# EAGLE design wavplayer-v4 (EAGLE 6.5.0)
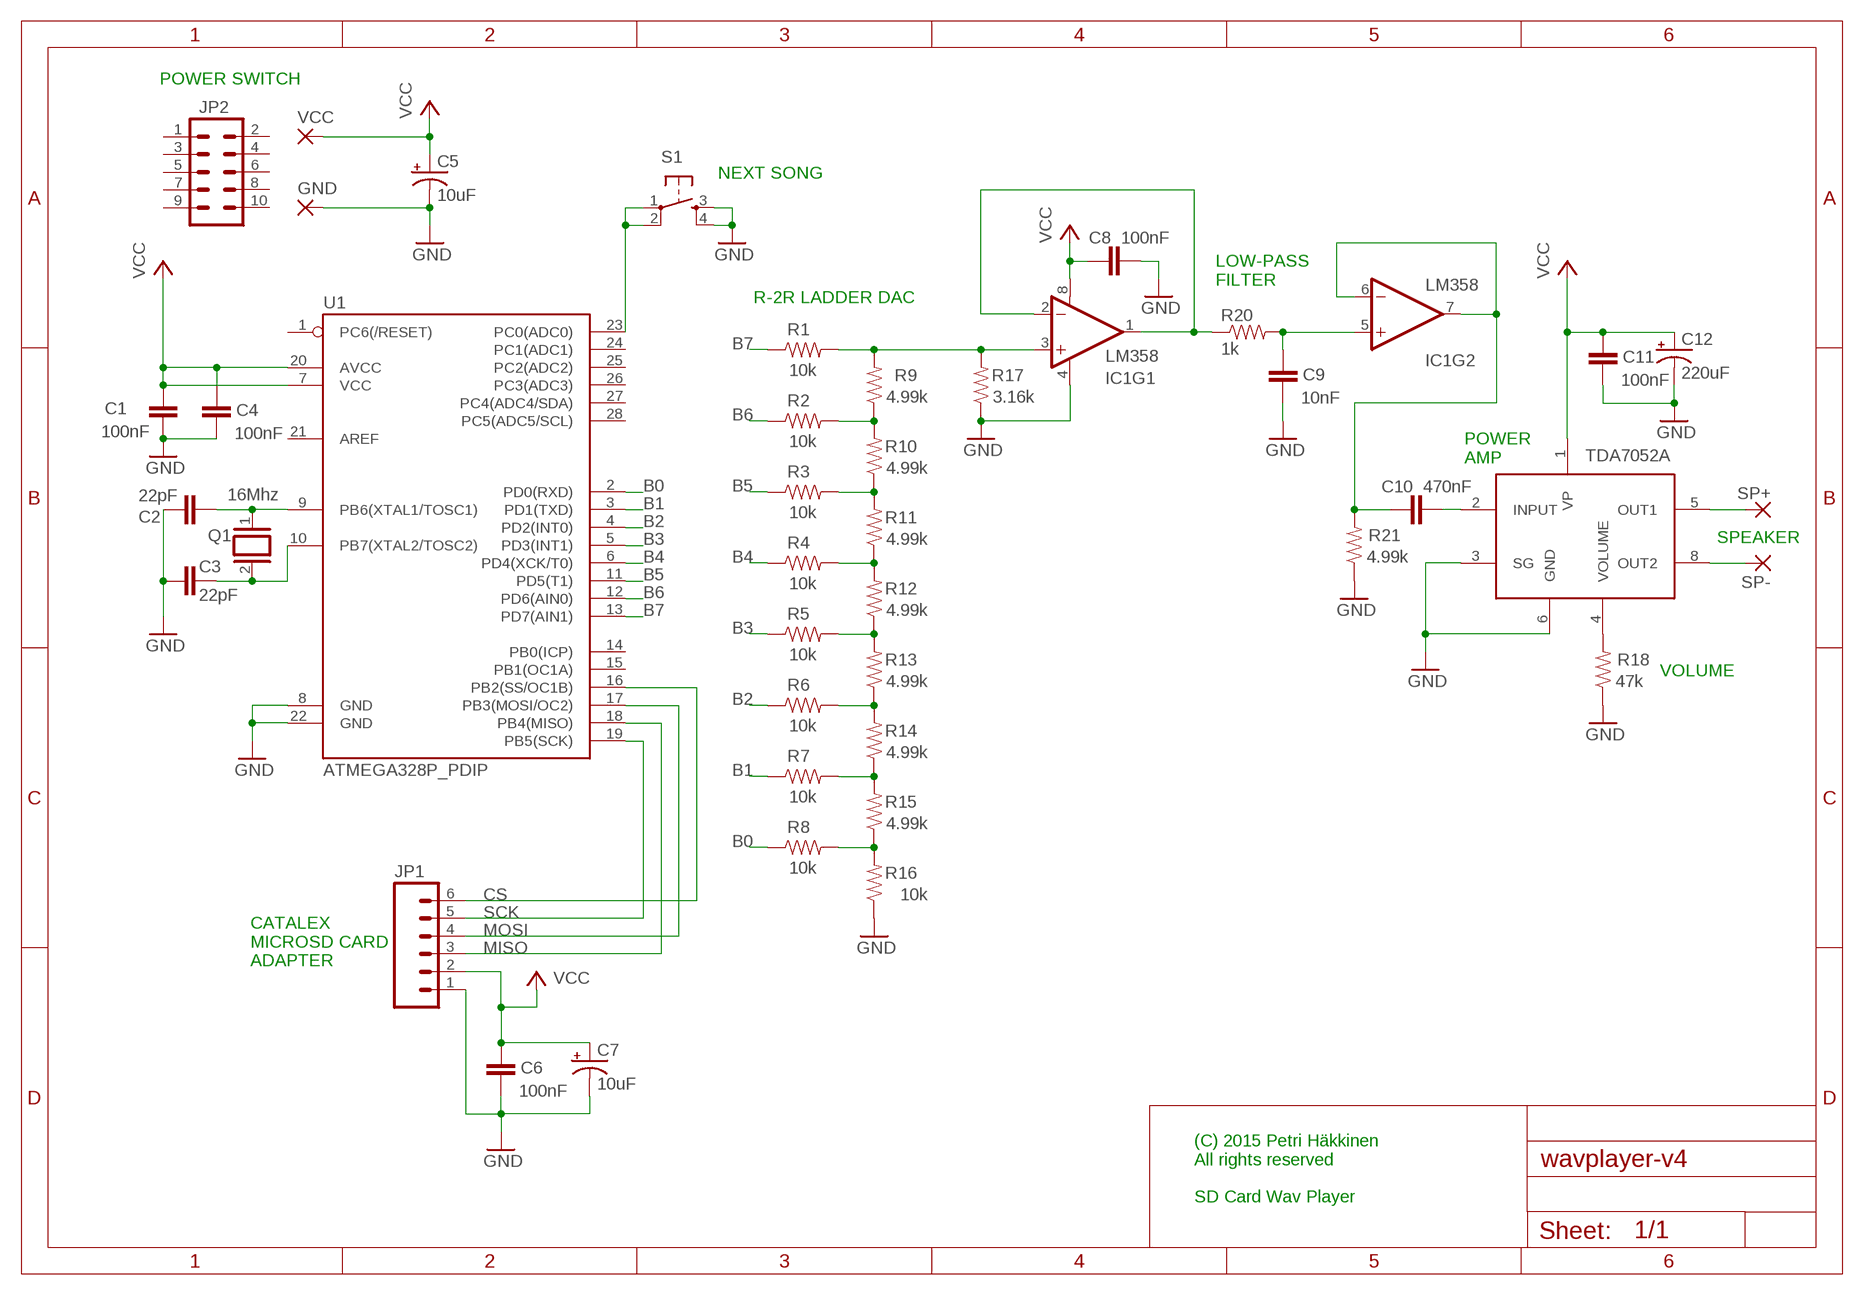
[diagram p0: schematic, sheet 1]

## Parts
C1  100nF  CAPPTH  [CAP-PTH-SMALL]
C2  22pF  CAPPTH  [CAP-PTH-SMALL]
C3  22pF  CAPPTH  [CAP-PTH-SMALL]
C4  100nF  CAPPTH  [CAP-PTH-SMALL]
C5  10uF  CAP_POLPTH1  [CPOL-RADIAL-100UF-25V]
C6  100nF  CAPPTH  [CAP-PTH-SMALL]
C7  10uF  CAP_POLPTH1  [CPOL-RADIAL-100UF-25V]
C8  100nF  CAPPTH  [CAP-PTH-SMALL]
C9  10nF  CAPPTH  [CAP-PTH-SMALL]
C10  470nF  CAPPTH  [CAP-PTH-SMALL]
C11  100nF  CAPPTH  [CAP-PTH-SMALL]
C12  220uF  CAP_POLPTH1  [CPOL-RADIAL-100UF-25V]
GND  WIREPAD2,15/1,0  [2,15/1,0]
IC1  LM358  [DIP08]
JP1  M06LONGPADS  [1X06_LONGPADS]
JP2  M05X2NO_SILK  [2X5_NOSILK]
Q1  16Mhz  XTAL/S  [QS]
R1  10k  RESISTORPTH-1/4W  [AXIAL-0.4]
R2  10k  RESISTORPTH-1/4W  [AXIAL-0.4]
R3  10k  RESISTORPTH-1/4W  [AXIAL-0.4]
R4  10k  RESISTORPTH-1/4W  [AXIAL-0.4]
R5  10k  RESISTORPTH-1/4W  [AXIAL-0.4]
R6  10k  RESISTORPTH-1/4W  [AXIAL-0.4]
R7  10k  RESISTORPTH-1/4W  [AXIAL-0.4]
R8  10k  RESISTORPTH-1/4W  [AXIAL-0.4]
R9  4.99k  RESISTORPTH-1/4W  [AXIAL-0.4]
R10  4.99k  RESISTORPTH-1/4W  [AXIAL-0.4]
R11  4.99k  RESISTORPTH-1/4W  [AXIAL-0.4]
R12  4.99k  RESISTORPTH-1/4W  [AXIAL-0.4]
R13  4.99k  RESISTORPTH-1/4W  [AXIAL-0.4]
R14  4.99k  RESISTORPTH-1/4W  [AXIAL-0.4]
R15  4.99k  RESISTORPTH-1/4W  [AXIAL-0.4]
R16  10k  RESISTORPTH-1/4W  [AXIAL-0.4]
R17  3.16k  RESISTORPTH-1/4W  [AXIAL-0.4]
R18  47k  RESISTORPTH-1/4W-VERT  [AXIAL-0.1]
R20  1k  RESISTORPTH-1/4W  [AXIAL-0.4]
R21  4.99k  RESISTORPTH-1/4W  [AXIAL-0.4]
S1  TAC_SWITCHPTH  [TACTILE-PTH]
SP+  WIREPAD2,15/1,0  [2,15/1,0]
SP-  WIREPAD2,15/1,0  [2,15/1,0]
U1  ATMEGA328P_PDIP  [DIL28-3]
U$1  TDA7052B  [DIL08]
VCC  WIREPAD2,15/1,0  [2,15/1,0]

## Nets
B0: R8.P$1 U1.2(PD0(RXD))
B1: R7.P$1 U1.3(PD1(TXD))
B2: R6.P$1 U1.4(PD2(INT0))
B3: R5.P$1 U1.5(PD3(INT1))
B4: R4.P$1 U1.6(PD4(XCK/T0))
B5: R3.P$1 U1.11(PD5(T1))
B6: R2.P$1 U1.12(PD6(AIN0))
B7: R1.P$1 U1.13(PD7(AIN1))
CS: JP1.6 U1.16(PB2(SS/OC1B))
GND: C1.2 C2.2 C3.2 C4.2 C5.2(-) C6.2 C7.2(-) C8.2 C9.2 C11.2 C12.2(-) GND.1(P) IC1.4(V-) JP1.1 R16.P$1 R17.P$1 R18.P$1 R21.P$1 S1.3 S1.4 U1.8(GND) U1.22(GND) U$1.3(SG) U$1.6(GND)
MISO: JP1.3 U1.18(PB4(MISO))
MOSI: JP1.4 U1.17(PB3(MOSI/OC2))
N$1: C2.1 Q1.1 U1.9(PB6(XTAL1/TOSC1))
N$2: C3.1 Q1.2 U1.10(PB7(XTAL2/TOSC2))
N$3: R4.P$2 R11.P$1 R12.P$2
N$4: R5.P$2 R12.P$1 R13.P$2
N$5: R6.P$2 R13.P$1 R14.P$2
N$6: R3.P$2 R10.P$1 R11.P$2
N$7: R7.P$2 R14.P$1 R15.P$2
N$8: R2.P$2 R9.P$1 R10.P$2
N$9: R8.P$2 R15.P$1 R16.P$2
N$10: IC1.3(+IN) R1.P$2 R9.P$2 R17.P$2
N$11: C9.1 IC1.5(+IN) R20.P$2
N$12: C10.1 IC1.6(-IN) IC1.7(OUT) R21.P$2
N$13: IC1.1(OUT) IC1.2(-IN) R20.P$1
N$14: SP-.1(P) U$1.8(OUT2)
N$16: SP+.1(P) U$1.5(OUT1)
N$18: C10.2 U$1.2(INPUT)
N$19: R18.P$2 U$1.4(VOLUME)
N$25: S1.1 S1.2 U1.23(PC0(ADC0))
SCK: JP1.5 U1.19(PB5(SCK))
VCC: C1.1 C4.1 C5.1(+) C6.1 C7.1(+) C8.1 C11.1 C12.1(+) IC1.8(V+) JP1.2 U1.7(VCC) U1.20(AVCC) U$1.1(VP) VCC.1(P)
Unconnected: JP2.1 JP2.2 JP2.3 JP2.4 JP2.5 JP2.6 JP2.7 JP2.8 JP2.9 JP2.10 U1.1(PC6(/RESET)) U1.14(PB0(ICP)) U1.15(PB1(OC1A)) U1.21(AREF) U1.24(PC1(ADC1)) U1.25(PC2(ADC2)) U1.26(PC3(ADC3)) U1.27(PC4(ADC4/SDA)) U1.28(PC5(ADC5/SCL))

## Notes on the sheet
- POWER SWITCH
- NEXT SONG
- LOW-PASS
  FILTER
- R-2R LADDER DAC
- TDA7052A
- POWER
  AMP
- SPEAKER
- VOLUME
- CATALEX
  MICROSD CARD
  ADAPTER
- (C) 2015 Petri Häkkinen
  All rights reserved
  
  SD Card Wav Player

## Library data of the parts
C1-C4 C6 C8-C11 = SparkFun-Capacitors:CAP: Capacitor Standard 0603 ceramic capacitor, and 0.1" leaded capacitor.
C5 C7 C12 = SparkFun-Capacitors:CAP_POL: Capacitor Polarized These are standard SMD and PTH capacitors. Normally 10uF, 47uF, and 100uF in electrolytic and tantalum varieties. Always verify the external diameter of the through hole cap, it varies with capacity, voltage, and manufacturer. The EIA devices should be standard.
GND SP+ SP- VCC = wirepad:WIREPAD: Wire PAD connect wire on PCB
IC1 = SparkFun-AnalogIC:LM358: Jellybean op-amp; PROD_ID: IC-09172
JP1 = SparkFun-Connectors:M06: Header 6 Standard 6-pin 0.1" header. Use with straight break away headers (SKU : PRT-00116), right angle break away headers (PRT-00553), swiss pins (PRT-00743), machine pins (PRT-00117), and female headers (PRT-00115). Molex polarized connector foot print use with SKU : PRT-08094 with associated crimp pins and housings. NOTES ON THE VARIANTS LOCK and LOCK_LONGPADS... This footprint was designed to help hold the alignment of a through-hole component (i.e. 6-pin header) while soldering it into place. You may notice that each hole has been shifted either up or down by 0.005 of an inch from it's more standard position (which is a perfectly straight line). This slight alteration caused the pins (the squares in the middle) to touch the edges of the holes. Because they are alternating, it causes a "brace" to hold the component in place. 0.005 has proven to be the perfect amount of "off-center" position when using our standard breakaway headers. Although looks a little odd when you look at the bare footprint, once you have a header in there, the alteration is very hard to notice. Also,if you push a header all the way into place, it is covered up entirely on the bottom side. This idea of altering the position of holes to aid alignment will be further integrated into the Sparkfun Library for other footprints. It can help hold any component with 3 or more connection pins.
JP2 = SparkFun-Connectors:M05X2: Header 5x2 Standard 10-pin dual row 0.1" header. Commonly used with AVR-ISP. Use with Spark Fun Electronics SKU: PRT-00778
Q1 = special:XTAL/S: CRYSTAL
R1-R17 R20 R21 = SparkFun-Passives:RESISTOR: Resistor Basic schematic elements and footprints for 0603, 1206, and PTH resistors.
R18 = SparkFun-Resistors:RESISTOR: Resistor Basic schematic elements and footprints for 0603, 1206, and PTH resistors.
S1 = SparkFun-Electromechanical:TAC_SWITCH: Momentary Switch Button commonly used for reset or general input. Spark Fun Electronics SKU : COM-00097 SMT- SWCH-08247
U1 = SparkFun-DigitalIC:ATMEGA328P_PDIP: uC used in the Arduino 32kb flash, 1k EEPROM, 2k SRAM This is the through-hole version of this chip.
U$1 = tda7052b:TDA7052B: 1W Mono audio amplifier

## Board
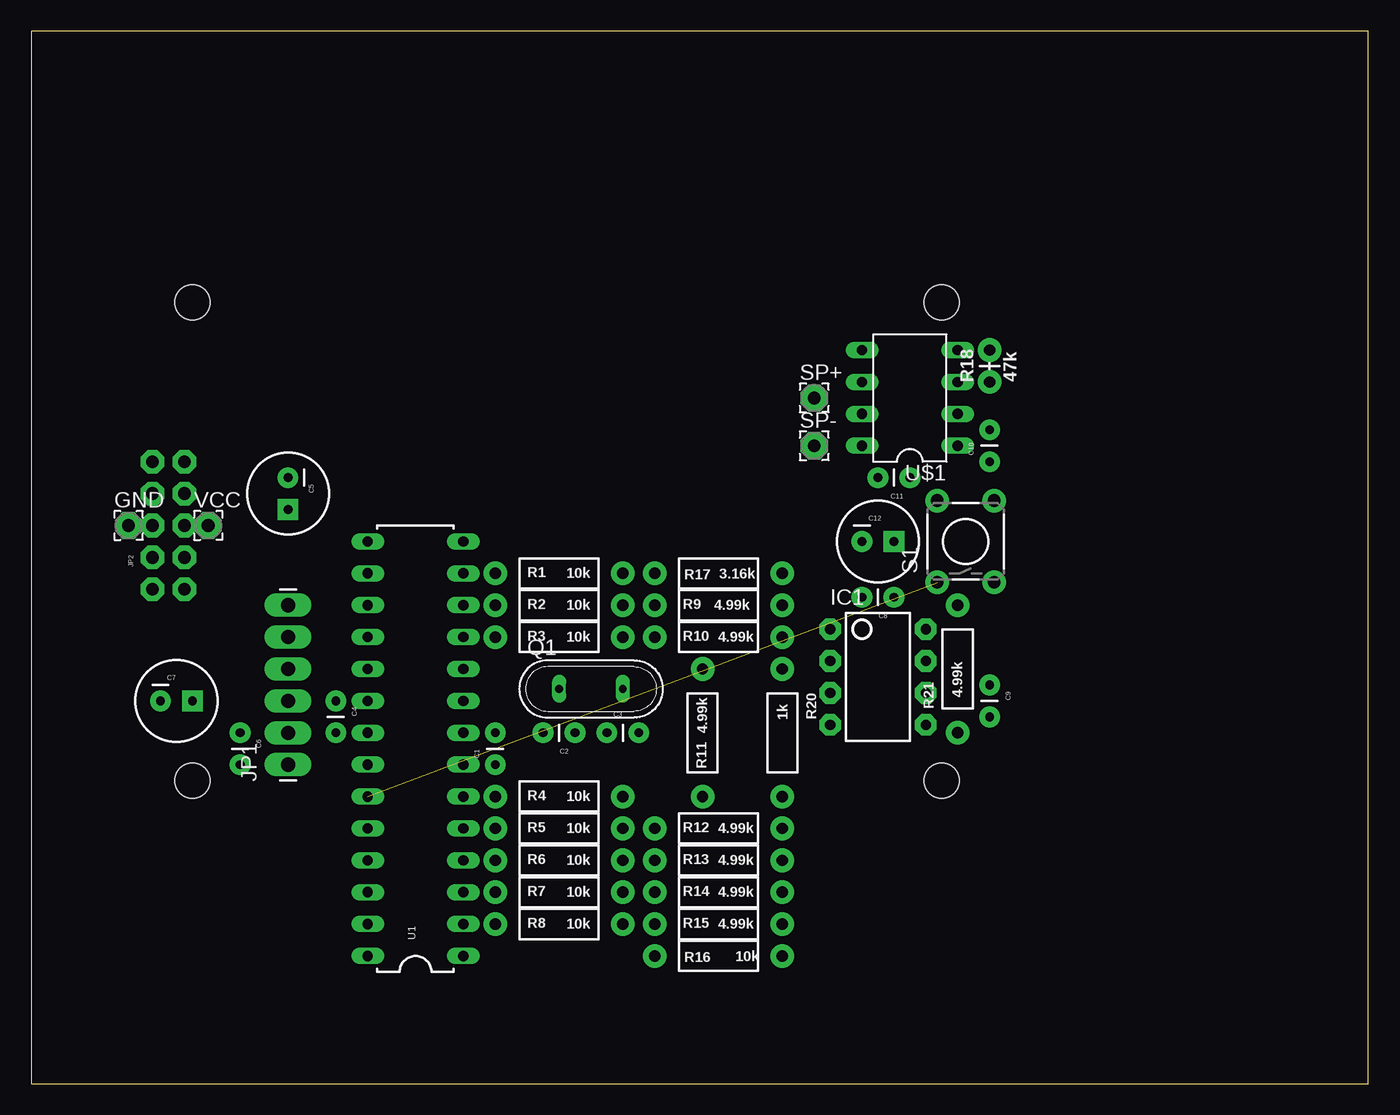
[diagram p1: board, top side]
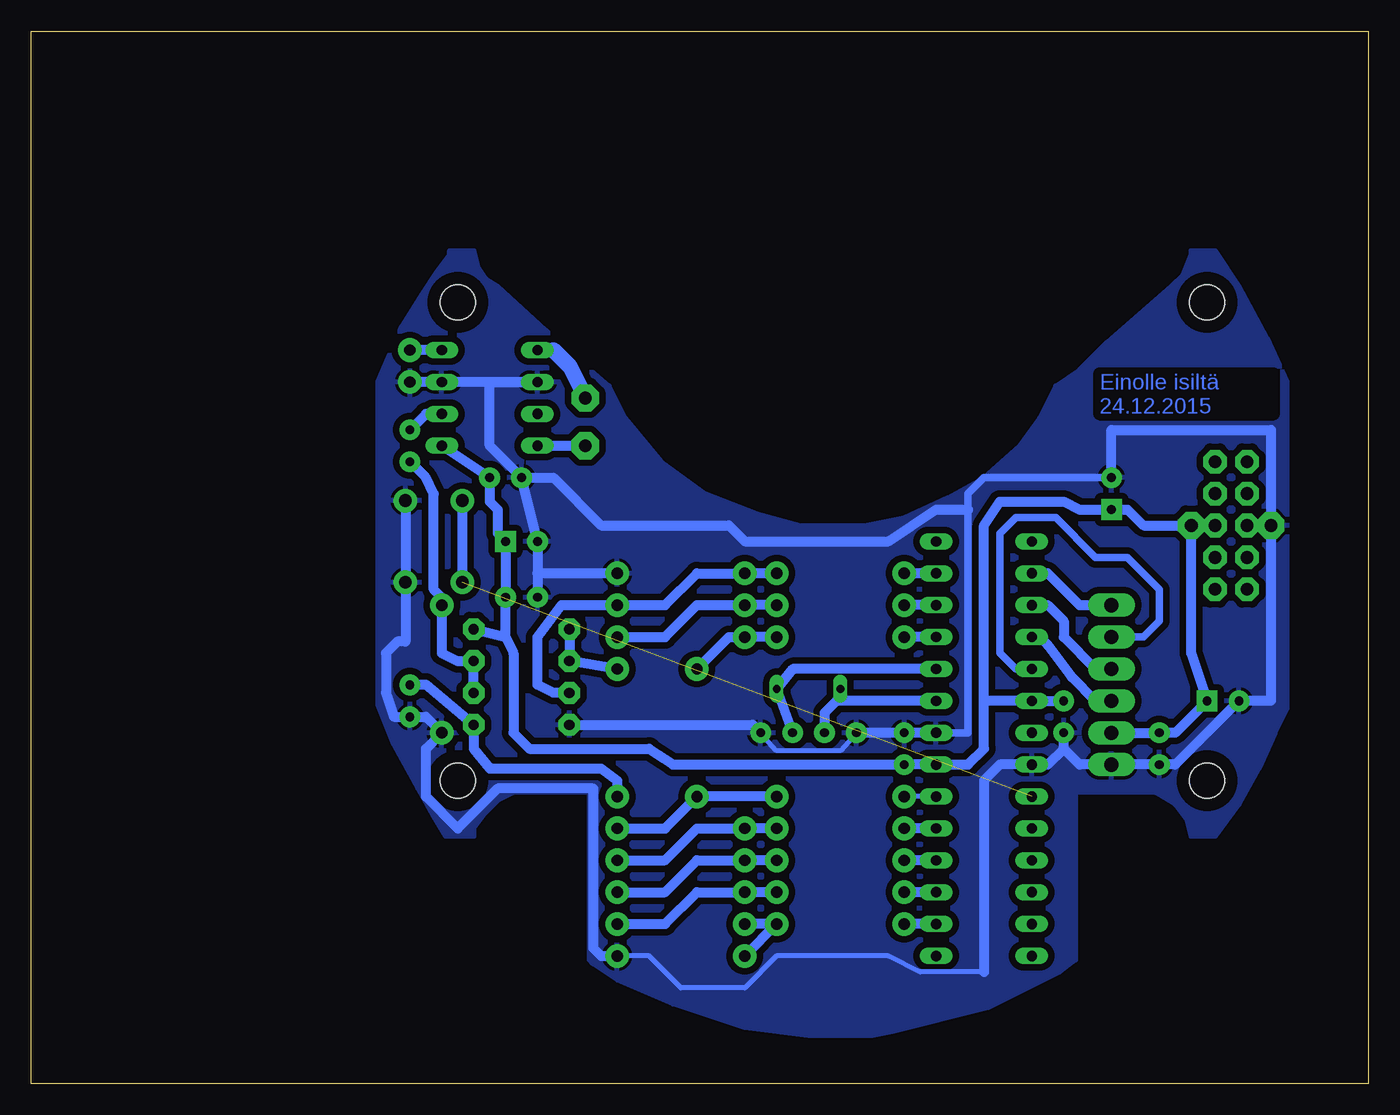
[diagram p2: board, bottom side, seen from below]

Size 106.47 x 83.81 mm. Coordinates in mm from the lower left corner, seen from the top.
Outline: 0,0 106.47,0 106.47,83.81 0,83.81 0,0
Copper layers (1*16): Top 0.035mm / dielectric 1.5mm / Bottom 0.035mm
Design rules "default": minimum track width 10mil, minimum drill 24mil, track to track 8mil, track to pad 8mil, pad to pad 8mil, via to via 8mil, smd to smd 8mil, copper to edge 40mil, drill to drill 8mil, minimum pad ring 10mil, minimum via ring 8mil, stop-mask expansion 4mil, vias tented up to drill 0mil, thermal gap 10mil
Holes 2.8 mm at 12.82,62.23 12.82,24.13 72.51,62.23 72.51,24.13

### Footprints (pad centres in the part's own frame; a part is rotated, then mirrored left to right if it is on the bottom)
CAP-PTH-SMALL = drill 0.7 pad 1.651: 1 0,0; 2 2.54,0
CPOL-RADIAL-100UF-25V = drill 0.7 pad 1.651 square: 1 1.27,0 | drill 0.7 pad 1.651: 2 -1.27,0
2,15/1,0 = drill 1.016 pad 2.159 octagon: 1 0,0
DIP08 = drill 0.813 pad 1.727 octagon: 1 -3.81,-3.81; 2 -1.27,-3.81; 3 1.27,-3.81; 4 3.81,-3.81; 5 3.81,3.81; 6 1.27,3.81; 7 -1.27,3.81; 8 -3.81,3.81
1X06_LONGPADS = drill 1.118 pad 1.88 long: 1 0,0; 2 2.54,0; 3 5.08,0; 4 7.62,0; 5 10.16,0; 6 12.7,0
2X5_NOSILK = drill 1.016 pad 1.88 octagon: 1 -1.27,5.08; 2 1.27,5.08; 3 -1.27,2.54; 4 1.27,2.54; 5 -1.27,0; 6 1.27,0; 7 -1.27,-2.54; 8 1.27,-2.54; 9 -1.27,-5.08; 10 1.27,-5.08
QS = drill 0.61 long: 1 -2.54,0; 2 2.54,0
AXIAL-0.4 = drill 0.9 pad 1.88: P$1 -5.08,0; P$2 5.08,0
AXIAL-0.1 = drill 0.9 pad 1.88: P$1 0,0; P$2 2.54,0
TACTILE-PTH = drill 1.016 pad 1.88: 1 -3.251,2.261; 2 3.251,2.261; 3 -3.251,-2.261; 4 3.251,-2.261
DIL28-3 = drill 0.813 long: 1 -16.51,-3.81; 2 -13.97,-3.81; 3 -11.43,-3.81; 4 -8.89,-3.81; 5 -6.35,-3.81; 6 -3.81,-3.81; 7 -1.27,-3.81; 8 1.27,-3.81; 9 3.81,-3.81; 10 6.35,-3.81; 11 8.89,-3.81; 12 11.43,-3.81; 13 13.97,-3.81; 14 16.51,-3.81; 15 16.51,3.81; 16 13.97,3.81; 17 11.43,3.81; 18 8.89,3.81; 19 6.35,3.81; 20 3.81,3.81; 21 1.27,3.81; 22 -1.27,3.81; 23 -3.81,3.81; 24 -6.35,3.81; 25 -8.89,3.81; 26 -11.43,3.81; 27 -13.97,3.81; 28 -16.51,3.81
DIL08 = drill 0.813 long: 1 -3.81,-3.81; 2 -1.27,-3.81; 3 1.27,-3.81; 4 3.81,-3.81; 5 3.81,3.81; 6 1.27,3.81; 7 -1.27,3.81; 8 -3.81,3.81

### Placement (x,y rotation side)
C1  36.95,25.4 90 top
C2  43.3,27.94 180 top
C3  45.84,27.94 0 top
C4  24.25,30.48 270 top
C5  20.44,46.99 270 top
C6  16.63,27.94 270 top
C7  11.55,30.48 0 top
C8  68.7,38.73 180 top
C9  76.32,31.75 270 top
C10  76.32,49.53 90 top
C11  69.97,48.26 180 top
C12  67.43,43.18 0 top
GND  7.74,44.45 0 top
IC1  67.43,32.38 270 top
JP1  20.44,25.4 90 top
JP2  10.91,44.45 0 top
Q1  44.57,31.43 0 top
R1  42.03,40.64 0 top
R2  42.03,38.1 0 top
R3  42.03,35.56 0 top
R4  42.03,22.86 0 top
R5  42.03,20.32 0 top
R6  42.03,17.78 0 top
R7  42.03,15.24 0 top
R8  42.03,12.7 0 top
R9  54.73,38.1 0 top
R10  54.73,35.56 0 top
R11  53.46,27.94 90 top
R12  54.73,20.32 0 top
R13  54.73,17.78 0 top
R14  54.73,15.24 0 top
R15  54.73,12.7 0 top
R16  54.73,10.16 180 top
R17  54.73,40.64 180 top
R18  76.32,55.88 90 top
R20  59.81,27.94 270 top
R21  73.78,33.02 90 top
S1  74.41,43.18 90 top
SP+  62.35,54.61 0 top
SP-  62.35,50.8 0 top
U1  30.6,26.67 90 top
U$1  69.97,54.61 90 top
VCC  14.09,44.45 0 top

### Tracks (layer width: path | path; a pad name or v marks a point on that pad's centre or on a via)
B0
  Bottom 0.813: U1.2 R8.P$1
B1
  Bottom 0.813: U1.3 R7.P$1
B2
  Bottom 0.813: U1.4 R6.P$1
B3
  Bottom 0.813: U1.5 R5.P$1
B4
  Bottom 0.406: U1.6 R4.P$1
B5
  Bottom 0.813: U1.11 R3.P$1
B6
  Bottom 0.813: U1.12 R2.P$1
B7
  Bottom 0.813: U1.13 R1.P$1
CS
  Bottom 0.813: U1.16 25.52,40.64 22.98,38.1 JP1.6
FILL
  pour Bottom (isolate 0.508): 39.49,3.81 44.57,3.81 49.65,4.45 55.36,6.35 59.81,8.26 61.71,9.53 62.03,9.84 62.03,23.18 68.06,23.18 69.33,22.54 70.29,21.59 71.24,20.32 71.24,19.68 73.46,19.68 74.41,21.27 75.68,23.49 77.59,26.99 78.86,30.16 78.86,55.88 76.95,60.33 75.37,62.87 74.1,64.77 73.14,66.04 73.14,66.36 71.24,66.36 70.92,65.09 70.29,64.14 69.33,63.5 65.52,60.01 64.89,59.37 60.44,55.56 59.17,53.02 56.32,49.53 52.82,46.99 48.7,45.4 45.2,44.45 40.12,44.45 36.95,45.09 33.46,46.67 30.6,48.26 27.74,50.8 26.15,53.02 24.88,55.56 22.98,56.83 20.76,59.05 15.68,63.5 14.72,64.45 14.09,66.04 14.09,66.36 12.18,66.36 10.28,63.5 8.06,59.37 6.47,55.88 6.47,29.84 7.42,27.94 8.69,25.08 10.28,22.22 12.18,19.68 14.09,19.68 14.41,20.95 15.36,22.22 16.95,23.18 23.3,23.18 23.3,9.84 24.57,8.89 30.28,6.03 37.9,4.13
GND
  Bottom 0.406: C2.2 42.03,26.51 47.11,26.51 C3.2 | 30.6,8.89 35.68,8.89 38.22,10.16 47.11,10.16 49.65,7.62 54.73,7.62 57.27,10.16 R16.P$1
  Bottom 0.61: U1.8 31.87,27.94 31.87,45.72 31.87,46.99 30.6,48.26 C5.2
  Bottom 0.813: 30.6,8.89 30.6,24.13 29.33,25.4 U1.22 25.52,25.4 24.25,26.67 | 24.25,26.67 C4.2 | 24.25,26.67 22.98,25.4 JP1.1 C6.2 15.36,25.4 C7.2 7.74,30.48 GND.1 7.74,52.07 20.44,52.07 C5.2 | U1.8 C1.2 C2.2 | 66.16,40.64 C12.2 C11.2 | 66.16,40.64 C8.2 | S1.3 S1.4 76.68,35.2 77.31,35.2 78.22,34.29 78.22,31.11 77.59,29.21 C9.2 75.05,29.21 R21.P$1 75.05,26.67 75.05,22.86 72.51,20.32 69.33,23.49 61.71,23.49 61.71,10.79 61.08,10.16 R16.P$1 | R18.P$1 U$1.3 U$1.6 69.97,55.88 69.97,50.8 C11.2 | R17.P$1 66.16,40.64 | C11.2 64.89,48.26 61.08,44.45 50.92,44.45 49.65,43.18 38.22,43.18 34.41,45.72 31.87,45.72 | IC1.4 49.01,28.57 C3.2
  pour Bottom (isolate 0.508): 39.49,3.81 44.57,3.81 49.65,4.45 55.36,6.35 59.81,8.26 61.71,9.53 62.03,9.84 62.03,23.18 68.06,23.18 69.33,22.54 70.29,21.59 71.24,20.32 71.24,19.68 73.46,19.68 74.41,21.27 75.68,23.49 77.59,26.99 78.86,30.16 78.86,55.88 76.95,60.33 75.37,62.87 74.1,64.77 73.14,66.04 73.14,66.36 71.24,66.36 70.92,65.09 70.29,64.14 69.33,63.5 65.52,60.01 64.89,59.37 60.44,55.56 59.17,53.02 56.32,49.53 52.82,46.99 48.7,45.4 45.2,44.45 40.12,44.45 36.95,45.09 33.46,46.67 30.6,48.26 27.74,50.8 26.15,53.02 24.88,55.56 22.98,56.83 20.76,59.05 15.68,63.5 14.72,64.45 14.09,66.04 14.09,66.36 12.18,66.36 10.28,63.5 8.06,59.37 6.47,55.88 6.47,29.84 7.42,27.94 8.69,25.08 10.28,22.22 12.18,19.68 14.09,19.68 14.41,20.95 15.36,22.22 16.95,23.18 23.3,23.18 23.3,9.84 24.57,8.89 30.28,6.03 37.9,4.13
MISO
  Bottom 0.813: JP1.3 21.71,30.48 23.61,32.38 25.52,34.92 26.15,35.56 U1.18
MOSI
  Bottom 0.813: U1.17 25.52,38.1 24.25,36.83 24.25,35.56 21.71,33.02 JP1.4
N$1
  Bottom 0.813: U1.9 42.03,30.48 Q1.1 42.03,30.8 43.3,29.53 C2.1
N$2
  Bottom 0.813: U1.10 45.84,33.02 Q1.2 C3.1
N$3
  Bottom 0.813: R4.P$2 R11.P$1 56,20.32 R12.P$2
N$4
  Bottom 0.813: R5.P$2 R12.P$1 53.46,20.32 56,17.78 R13.P$2
N$5
  Bottom 0.813: R6.P$2 R13.P$1 53.46,17.78 56,15.24 R14.P$2
N$6
  Bottom 0.813: R3.P$2 R10.P$1 50.92,35.56 R11.P$2
N$7
  Bottom 0.813: R7.P$2 R14.P$1 53.46,15.24 56,12.7 R15.P$2
N$8
  Bottom 0.813: R2.P$2 R9.P$1 53.46,38.1 56,35.56 R10.P$2
N$9
  Bottom 0.813: R15.P$1 R8.P$2 R16.P$2
N$10
  Bottom 0.813: R1.P$2 R17.P$2 53.46,40.64 56,38.1 R9.P$2 64.25,38.1 66.16,35.56 66.16,31.75 64.89,31.11 IC1.3
N$11
  Bottom 0.813: C9.1 75.05,31.75 IC1.5 71.24,26.67 69.97,25.08 61.08,25.08 59.81,24.13 R20.P$2
N$12
  Bottom 0.813: C10.1 75.05,48.26 74.41,46.99 74.41,39.37 73.78,38.73 R21.P$2 73.78,34.29 72.51,33.66 IC1.7 IC1.6
N$13
  Bottom 0.813: IC1.1 IC1.2 R20.P$1
N$14
  Bottom 0.813: U$1.8 SP-.1
N$16
  Bottom 0.813: U$1.5 64.89,58.42
  Bottom 1.27: 64.89,58.42 63.62,57.15 SP+.1
N$18
  Bottom 0.813: C10.2 75.05,53.34 U$1.2
N$19
  Bottom 0.813: U$1.4 R18.P$2
N$25  (1 unrouted)
  Bottom 0.813: S1.2 S1.1
OUTLINE
  cutout Top (isolate 0.61): 39.49,3.81 44.57,3.81 49.65,4.45 55.36,6.35 59.81,8.26 61.71,9.53 62.03,9.84 62.03,23.18 68.06,23.18 69.33,22.54 70.29,21.59 71.24,20.32 71.24,19.68 73.46,19.68 74.41,21.27 75.68,23.49 77.59,26.99 78.86,30.16 78.86,55.88 76.95,60.33 75.37,62.87 74.1,64.77 73.14,66.04 73.14,66.36 71.24,66.36 70.92,65.09 70.29,64.14 69.33,63.5 65.52,60.01 64.89,59.37 60.44,55.56 59.17,53.02 56.32,49.53 52.82,46.99 48.7,45.4 45.2,44.45 40.12,44.45 36.95,45.09 33.46,46.67 30.6,48.26 27.74,50.8 26.15,53.02 24.88,55.56 22.98,56.83 20.76,59.05 15.68,63.5 14.72,64.45 14.09,66.04 14.09,66.36 12.18,66.36 10.28,63.5 8.06,59.37 6.47,55.88 6.47,29.84 7.42,27.94 8.69,25.08 10.28,22.22 12.18,19.68 14.09,19.68 14.41,20.95 15.36,22.22 16.95,23.18 23.3,23.18 23.3,9.84 24.57,8.89 30.28,6.03 37.9,4.13
SCK
  Bottom 0.61: U1.19 28.06,33.02 29.33,34.29 29.33,43.82 28.06,45.09 24.88,45.09 21.71,41.91 19.17,41.91 16.63,39.37 16.63,36.83 17.9,35.56 JP1.5
VCC
  Bottom 0.813: 30.6,30.48 30.6,26.67 31.87,25.4 U1.7 C1.1 55.36,25.4 57.27,26.67 66.79,26.67 68.06,27.94 68.06,34.29 68.7,35.56 | 30.6,30.48 30.6,44.45 29.33,46.36 24.25,46.36 22.98,45.72 C5.1 19.17,45.72 17.9,44.45 VCC.1 14.09,34.29 C7.1 15.36,27.94 C6.1 JP1.2 21.71,27.94 | 30.6,30.48 U1.20 C4.1 | 68.7,35.56 C8.1 C12.1 69.33,43.82 69.33,45.72 69.97,46.36 C11.1 U$1.1 | IC1.8 68.7,35.56

### Text on the board
Bottom: Einolle isiltä / 24.12.2015
201bmp: /Users/petri/Dropbox/Elektroniikka/eino_wavplayer/eino_pcb_150dpi.bmp